# Altium schematic sheet ESP32 C3.SchDoc
size A3; SheetNumber: 2; SheetTotal: 2
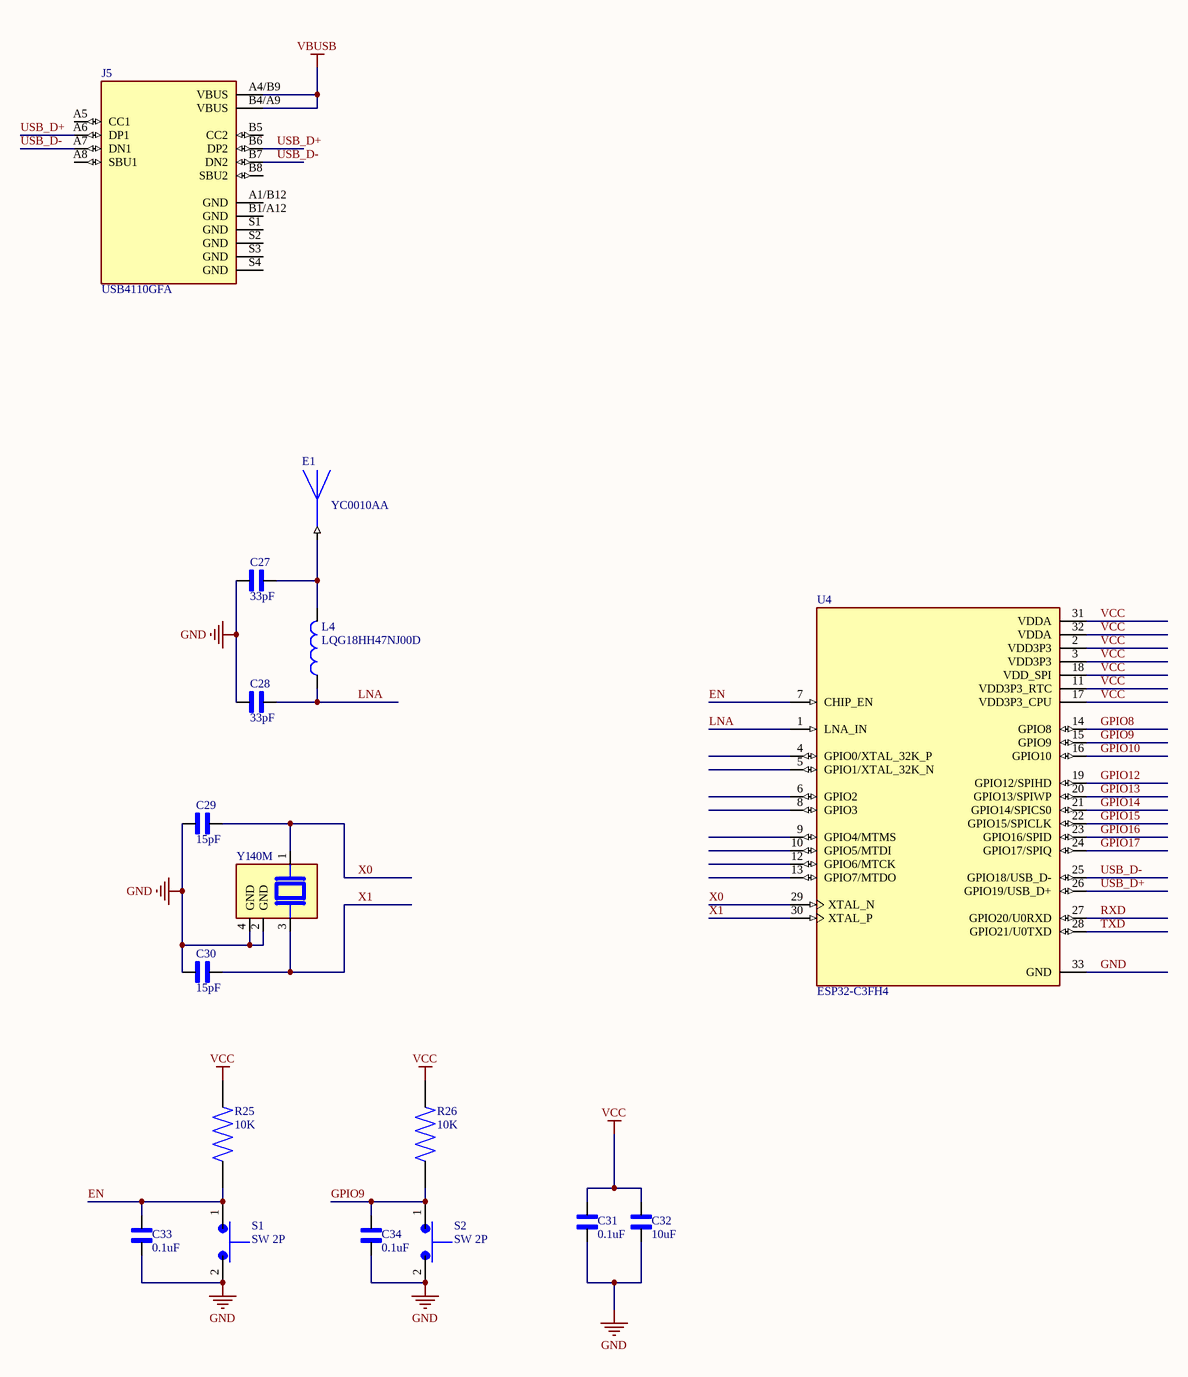
[diagram p0: ESP32 C3.SchDoc]

## Parts
C27  33pF  [CAPC2012X140N]
C28  33pF  [CAPC2012X140N]
C29  15pF  [CAPC2012X140N]
C30  15pF  [CAPC2012X140N]
C31  0.1uF  [CAPC2012X140N]
C32  10uF  [CAPC2012X140N]
C33  0.1uF  [CAPC2012X140N]
C34  0.1uF  [CAPC2012X140N]
E1  YC0010AA  [XCVR_YC0010AA]
J5  USB4110GFA  [GCT_USB4110GFA]
L4  LQG18HH47NJ00D  [INDC1608X95N]
R25  10K  [RESC2012X65N]
R26  10K  [RESC2012X65N]
S1  SW 2P  [SW_TS10-63-26-BE-250-SMT-TR]
S2  SW 2P  [SW_TS10-63-26-BE-250-SMT-TR]
U4  ESP32-C3FH4  [QFN50P500X500X90-33N]
Y1  40M  [XTAL_ABM12-26.000MHZ-B2X-T3]

## Nets
GND: C27.2 C28.2 C29.1 C30.2 C31.1 C32.1 C33.1 C34.1 S1.2 S2.2 U4.33(GND) Y1.2(GND) Y1.4(GND)
VBUSB: J5.A4/B9(VBUS) J5.B4/A9(VBUS)
VCC: C31.2 C32.2 R25.2 R26.2 U4.2(VDD3P3) U4.3(VDD3P3) U4.11(VDD3P3_RTC) U4.17(VDD3P3_CPU) U4.18(VDD_SPI) U4.31(VDDA) U4.32(VDDA)
EN: C33.2 R25.1 S1.1 U4.7(CHIP_EN)
GPIO8: U4.14(GPIO8)
GPIO9: C34.2 R26.1 S2.1 U4.15(GPIO9)
GPIO10: U4.16(GPIO10)
GPIO12: U4.19(GPIO12/SPIHD)
GPIO13: U4.20(GPIO13/SPIWP)
GPIO14: U4.21(GPIO14/SPICS0)
GPIO15: U4.22(GPIO15/SPICLK)
GPIO16: U4.23(GPIO16/SPID)
GPIO17: U4.24(GPIO17/SPIQ)
LNA: C28.1 L4.1 U4.1(LNA_IN)
RXD: U4.27(GPIO20/U0RXD)
TXD: U4.28(GPIO21/U0TXD)
USB_D+: J5.A6(DP1) J5.B6(DP2) U4.26(GPIO19/USB_D+)
USB_D-: J5.A7(DN1) J5.B7(DN2) U4.25(GPIO18/USB_D-)
X0: C29.2 U4.29(XTAL_N) Y1.1
X1: C30.1 U4.30(XTAL_P) Y1.3
NetC27_1: C27.1 E1.1 L4.2

Not connected (* = marked no-connect by the designer): J5 A1/B12(GND) A5(CC1) A8(SBU1) B1/A12(GND) B5(CC2) B8(SBU2) S1(GND) S2(GND) S3(GND) S4(GND); U4 4(GPIO0/XTAL_32K_P) 5(GPIO1/XTAL_32K_N) 6(GPIO2) 8(GPIO3) 9(GPIO4/MTMS) 10(GPIO5/MTDI) 12(GPIO6/MTCK) 13(GPIO7/MTDO)

## Library data of the parts
C27-C34 = CL21A226MQQNNNG: MF: {'manufacturer': u'Samsung Electro-Mechanics'}; Package: None; Price: None; Value: *; MP: CL21A226MQQNNNG; Availability: Unavailable
E1 = YC0010AA: 2400 ~ 2500MHz, Wi-Fiï¼ˆBTï¼‰, 5.2*2.0*1.2mm,ceramic SMD Antenna; MF: Quectel; SnapEDA_Link: https://www.snapeda.com/parts/YC0010AA/Quectel/view-part/?ref=snap; Package: None; Value: *; MP: YC0010AA; Check_prices: https://www.snapeda.com/parts/YC0010AA/Quectel/view-part/?ref=eda
J5 = USB4110GFA: USB-C (USB TYPE-C) USB 2.0 Receptacle Connector 24 (16+8 Dummy) Position Surface Mount, Right Angle; MF: Global Connector Technology; SnapEDA_Link: https://www.snapeda.com/parts/USB4110GFA/Global+Connector+Technology/view-part/?ref=snap; Package: None; Value: *; MP: USB4110GFA; Check_prices: https://www.snapeda.com/parts/USB4110GFA/Global+Connector+Technology/view-part/?ref=eda
L4 = LQG18HH47NJ00D: MF: {'manufacturer': u'Murata Electronics'}; Package: None; Price: None; Value: *; MP: LQG18HH47NJ00D; Availability: Unavailable
R25 R26 = MCR10EZHJ103: MF: {'manufacturer': u'Rohm'}; Package: None; Price: None; Value: *; MP: MCR10EZHJ103; Availability: Unavailable
S1 S2 = TS10-63-26-BE-250-SMT-TR: MF: {'manufacturer': u'Same Sky'}; Package: None; Price: None; Value: *; MP: TS10-63-26-BE-250-SMT-TR; Availability: Unavailable
U4 = ESP32-C3FH4: MF: {'manufacturer': u'Espressif Systems'}; Package: None; Price: None; Value: *; MP: ESP32-C3FH4; Availability: Unavailable
Y1 = ABM12-26.000MHZ-B2X-T3: MF: {'manufacturer': u'Abracon LLC'}; Package: None; Price: None; Value: *; MP: ABM12-26.000MHZ-B2X-T3; Availability: Unavailable